# Altium schematic sheet Serial.SchDoc: Serial connection
size A4; DrawnBy: Jarod Krane; SheetNumber: 8; SheetTotal: 8
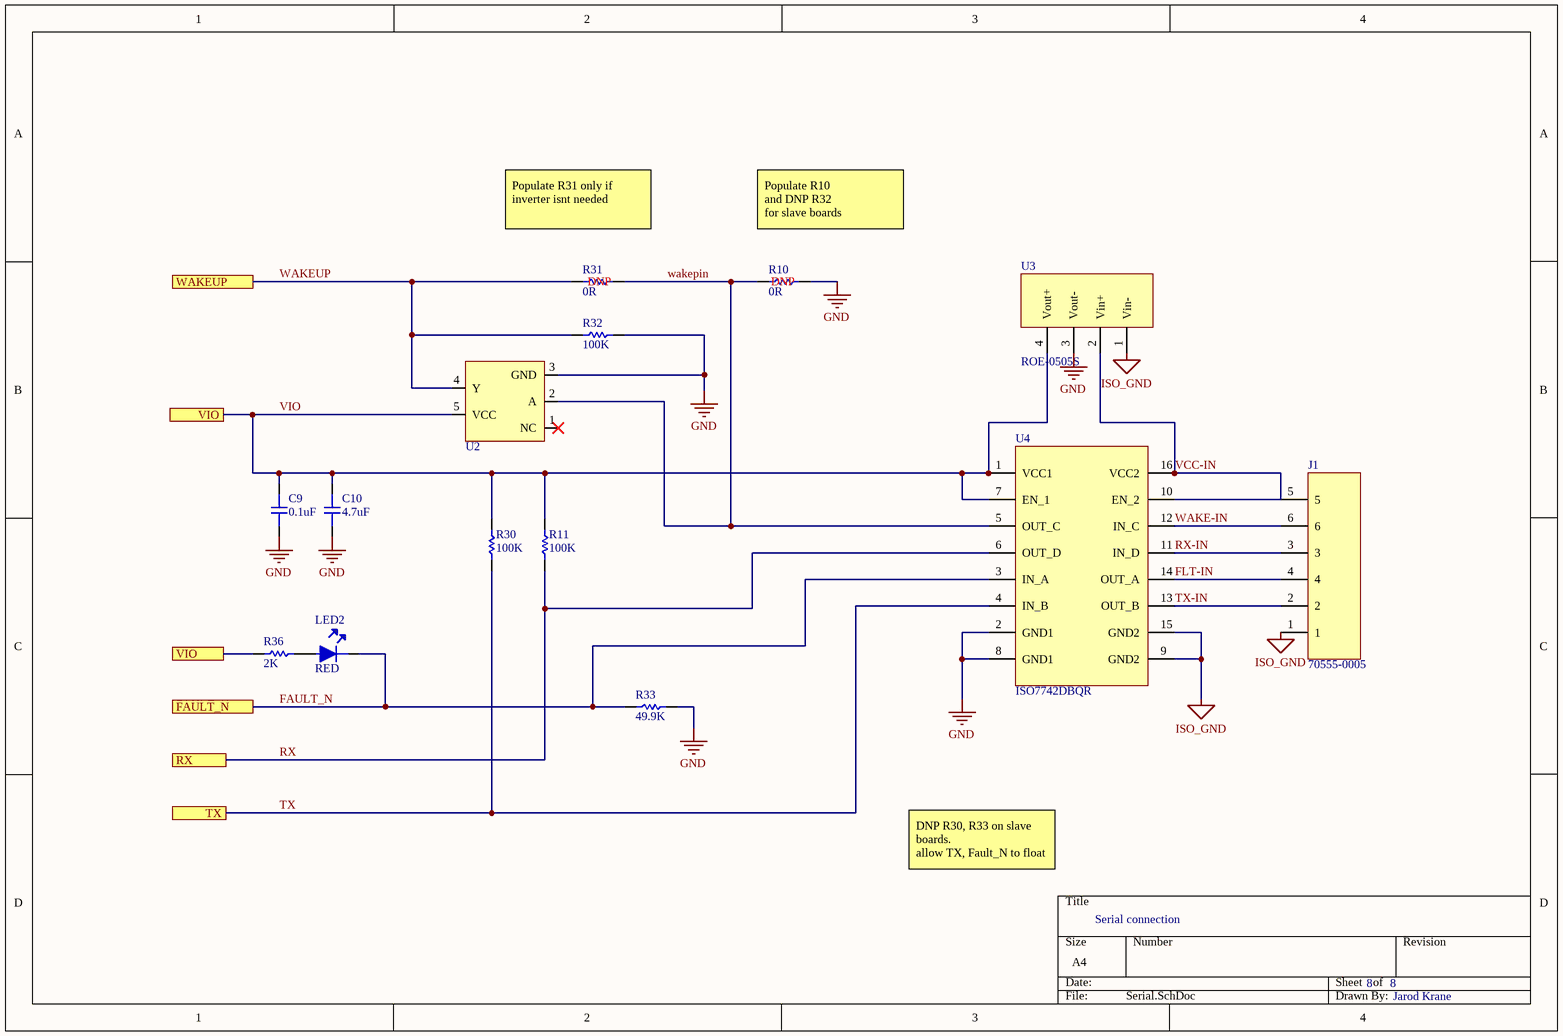
[diagram p0: Serial.SchDoc]

## Parts
C9  0.1uF  [0603 CAP - duplicate]
C10  4.7uF  [0805 CAP]
J1  70555-0005  [SERIAL HDR]
LED2  RED  [LED2]
R10  0R  [1206 RES]
R11  100K  [0603 RES]
R30  100K  [0603 RES]
R31  0R  [1206 RES]
R32  100K  [0603 RES]
R33  49.9K  [0603 RES]
R36  2K  [0603 RES]
U2  NC7SZ04M5X  [Inverter]  (value not drawn)
U3  ROE-0505S  [5V-ISO]
U4  ISO7742DBQR  [Serial-ISO]

## Ports
FAULT_N, RX, TX, VIO, WAKEUP

## Nets
GND: C9.1 C10.1 R10.2 R32.2 R33.2 U2.3(GND) U3.3(Vout-) U4.2(GND1) U4.8(GND1)
ISO_GND: J1.1 U3.1(Vin-) U4.9(GND2) U4.15(GND2)
FAULT_N: LED2.2 R33.1 U4.3(IN_A) ; port FAULT_N
FLT-IN: J1.4 U4.14(OUT_A)
RX: R11.1 U4.6(OUT_D) ; port RX
RX-IN: J1.3 U4.11(IN_D)
TX: R30.1 U4.4(IN_B) ; port TX
TX-IN: J1.2 U4.13(OUT_B)
VCC-IN: J1.5 U3.2(Vin+) U4.10(EN_2) U4.16(VCC2)
VIO: C9.2 C10.2 R11.2 R30.2 R36.2 U2.5(VCC) U3.4(Vout+) U4.1(VCC1) U4.7(EN_1) ; port VIO
WAKE-IN: J1.6 U4.12(IN_C)
wakepin: R10.1 R31.2 U2.2(A) U4.5(OUT_C)
WAKEUP: R31.1 R32.1 U2.4(Y) ; port WAKEUP
NetLED2_1: LED2.1 R36.1

Not connected (* = marked no-connect by the designer): U2 1(NC)*

## Notes on the sheet
- (near R31) Populate R31 only if inverter isnt needed
- (near R10) Populate R10
  and DNP R32
  for slave boards
- (near R31) DNP
- (near R10) DNP
- DNP R30, R33 on slave boards.
  allow TX, Fault_N to float
- 8

## Library data of the parts
C9 = 06035C104KAZ2A: CAP CER 0.1UF 50V X7R 0603; Manufacturer: Kyocera AVX; Capacitance: 100nF; Tolerance: 10%; Temperature Coefficient: 30ppm/°C; Supplier 1: Digi-Key; Manufacturer Part Number: 06035C104KAZ2A; Stock 1: 40000; Pricing 1: 1=0.23, 10=0.161, 100=0.0756, 500=0.053, 1000=0.0439 (USD); Mount: PCB,Surface Mount; Case/Package: 0603; Number of Pins: 2; Case Code (Metric): 1608; Case Code (Imperial): 0603; Contact Plating: Matte,Tin; Min Operating Temperature: -55°C; Max Operating Temperature: 125°C; Package Quantity: 1; Voltage Rating: 50V; Packaging: Tape and Reel; Voltage Rating (DC): 50V; Dielectric: X7R; Termination: SMD/SMT; Voltage: 50V; Features: Soft Termination; Length: 1.6mm; Height: 0.94mm; Width: 0.032inch; Thickness: 0.035inch; Depth: 0.81mm; Radiation Hardening: No; REACH SVHC: No SVHC; Lead Free: Lead Free; Supplier Part Number 1: 478-3540-1-ND
C10 = CL21B475KOFNFNE: CAP CER 4.7UF 16V X7R 0805; Manufacturer: Samsung; Tolerance: 10%; Supplier 1: Digi-Key; Manufacturer Part Number: CL21B475KOFNFNE; Stock 1: 20000; Pricing 1: 1=0.3, 10=0.208, 100=0.1181, 500=0.0833, 1000=0.0729 (USD); Mount: Surface Mount; Case/Package: 0805; Case Code (Metric): 2012; Case Code (Imperial): 0805; Min Operating Temperature: -55°C; Max Operating Temperature: 125°C; Package Quantity: 1; Packaging: Tape and Reel; Capacitance: 4.7uF; Voltage Rating: 16V; Dielectric: X7R; Length: 0.079inch; Height: 1.25mm; Width: 0.049inch; Thickness: 0.053inch; Depth: 1.25mm; Radiation Hardening: No; Supplier Part Number 1: 1276-2970-1-ND
J1 = 70555-0005: CONN HEADER 6POS .100 R/A TIN; Manufacturer: Molex; Contact Resistance: 30mR; Number of Contacts: 6; Current Rating: 3A; Voltage Rating: 250V; Gender: Female; Insulation Resistance: 1GR; Connector Type: Male Pin; Pitch: 2.54mm; Glow Wire Compliant: Non-compliant; Supplier 1: Digi-Key; Manufacturer Part Number: 70555-0005; Stock 1: 1593; Pricing 1: 1=1.19, 10=1.046, 100=0.902, 500=0.738, 1000=0.656, 5000=0.574, 10000=0.5453 (USD); Mount: Through Hole; Contact Plating: Tin; Contact Material: Brass,Bronze; Housing Color: Black; Housing Material: Polyester; Color: Black; Material: Brass; Min Operating Temperature: -40°C; Max Operating Temperature: 105°C; Number of Rows: 1; Packaging: Rail/Tube; Termination: Solder; Orientation: Right Angle; Package Quantity: 1; Contact Gender: Male; Number of Positions: 6; Voltage Rating (DC): 250V; Number of Circuits: 6; Length: 18.69mm; Depth: 13.59mm; Contact Mating Length: 0.24inch; ELV: Compliant; Flammability Rating: UL94 V-0; ComponentLink1URL: https://www.molex.com/pdm_docs/ps/PS-70400.pdf; ComponentLink1Description: https://www.molex.com/pdm_docs/ps/PS-70400.pdf; ComponentLink2URL: http://www.mouser.com/ds/2/276/0705550005_PCB_HEADERS-172795.pdf; ComponentLink2Description: http://www.mouser.com/ds/2/276/0705550005_PCB_HEADERS-172795.pdf; Supplier Part Number 1: WM4168-ND
LED2 = 150060VS75000: LED GREEN CLEAR 0603 SMD; Manufacturer: Wurth Electronics; Luminous Intensity: 40mcd; Viewing Angle: 140°; Forward Voltage: 2V; Wavelength: 570nm; Lens Style: Clear,Rectangular; Forward Current: 30mA; Test Current: 20mA; Supplier 1: Digi-Key; Manufacturer Part Number: 150060VS75000; Stock 1: 219425; Pricing 1: 1=0.14, 50=0.129, 100=0.11, 500=0.095 (USD); Mount: Surface Mount; Case/Package: 0603; Number of Pins: 2; Colour: Green; Case Code (Metric): 1608; Case Code (Imperial): 0603; Min Operating Temperature: -40°C; Max Operating Temperature: 85°C; Package Quantity: 1; Packaging: Tape and Reel; Dominant Wavelength: 570nm; Length: 1.6mm; Height: 0.7mm; Width: 0.8mm; REACH SVHC: Unknown; ComponentLink1URL: http://www.farnell.com/datasheets/1911347.pdf; ComponentLink1Description: http://www.farnell.com/datasheets/1911347.pdf; ComponentLink2URL: https://katalog.we-online.de/led/datasheet/150060VS75000.pdf; ComponentLink2Description: https://katalog.we-online.de/led/datasheet/150060VS75000.pdf; ComponentLink3URL: https://www.distrelec.biz/Web/Downloads/_t/ds/150060VS75000_eng_tds.pdf?mime=application%2Fpdf; ComponentLink3Description: https://www.distrelec.biz/Web/Downloads/_t/ds/150060VS75000_eng_tds.pdf?mime=application%2Fpdf; ComponentLink4URL: http://www.produktinfo.conrad.com/datenblaetter/750000-774999/759431-da-01-en-CHIPLED_0603_W_KL_H_GRUEN_150060VS7500.pdf; ComponentLink4Description: http://www.produktinfo.conrad.com/datenblaetter/750000-774999/759431-da-01-en-CHIPLED_0603_W_KL_H_GRUEN_150060VS7500.pdf; Supplier Part Number 1: 732-4980-1-ND
R10 R31 = 0
R11 R30 R32 = ERJ-3EKF1003V: RES SMD 100K OHM 1% 1/10W 0603; Manufacturer: Panasonic; Manufacturer Part Number: ERJ3EKF-1003V; Resistance: 100kR; Power Rating: 100mW; Voltage Rating: 75V; Temperature Coefficient: 100ppm/°C; Supplier 1: Digi-Key; Stock 1: 10349154; Pricing 1: 1=0.1, 10=0.064, 100=0.0261, 1000=0.0117, 2500=0.0102 (USD); Case/Package: 0603; Number of Pins: 2; Case Code (Metric): 1608; Case Code (Imperial): 0603; Contact Plating: Tin; Min Operating Temperature: -55°C; Max Operating Temperature: 155°C; Tolerance: 1%; Packaging: Tape and Reel; Composition: Thick Film; Military Standard: Not; Voltage Rating (DC): 75V; Length: 1.6mm; Depth: 0.8mm; Width: 800um; Radiation Hardening: No; REACH SVHC: No SVHC; Lead Free: Lead Free; Supplier Part Number 1: P100KHCT-ND
R33 = RC0603FR-0749K9L: RES SMD 49.9K OHM 1% 1/10W 0603
R36 = CRCW06032K00FKEA: RES SMD 2K OHM 1% 1/10W 0603; Manufacturer: Vishay; Power Rating: 100mW; Resistance: 2kR; Voltage Rating: 75V; Temperature Coefficient: 100ppm/°C; Supplier 1: Digi-Key; Manufacturer Part Number: CRCW06032K00FKEA; Stock 1: 388348; Pricing 1: 1=0.1, 10=0.042, 100=0.017, 1000=0.0076, 2500=0.0066 (USD); Mount: Surface Mount; Case/Package: 0603; Number of Pins: 2; Weight: 7.1E-05oz; Case Code (Imperial): 0603; Case Code (Metric): 1608; Contact Plating: Lead,Tin; Min Operating Temperature: -55°C; Max Operating Temperature: 155°C; Tolerance: 1%; Packaging: Tape and Reel; Composition: Thick Film; Package Quantity: 10; Military Standard: Not; Termination: Solder; Voltage Rating (DC): 75V; Number of Terminations: 2; Max Power Dissipation: 100mW; Features: Automotive AEC-Q200; Length: 1.55mm; Height: 0.45mm; Width: 0.85mm; Depth: 0.85mm; Radiation Hardening: No; REACH SVHC: Unknown; Lead Free: Lead Free; Supplier Part Number 1: 541-2.00KHCT-ND
U2 = NC7SZ04M5X: IC INVERTER 1CH 1-INP SOT23-5; Manufacturer: ON Semiconductor / Fairchild; Max Supply Voltage: 5.5V; Min Supply Voltage: 1.65V; Logic Function: Buffer,Inverter; High Level Output Current: -32mA; Low Level Output Current: 32mA; Propagation Delay: 12ns; Number of Circuits: 1; Quiescent Current: 2uA; Supplier 1: Digi-Key; Manufacturer Part Number: NC7SZ04M5X; Stock 1: 204255; Pricing 1: 1=0.48, 10=0.358, 100=0.203, 500=0.1344, 1000=0.1031 (USD); Mount: Surface Mount; Case/Package: SOT-23; Number of Pins: 5; Weight: 0.03g; Contact Plating: Tin,Matte; Min Operating Temperature: -40°C; Max Operating Temperature: 85°C; Packaging: Tape and Reel; Package Quantity: 1; Number of Inputs: 1; Output Current: 32mA; Number of Elements: 1; Turn-On Delay Time: 12ns; Radiation Hardening: No; REACH SVHC: No SVHC; Lead Free: Lead Free; ComponentLink1URL: http://www.jameco.com/Jameco/Products/ProdDS/1015511.pdf?src-supplier=Jameco; ComponentLink1Description: http://www.jameco.com/Jameco/Products/ProdDS/1015511.pdf?src-supplier=Jameco; ComponentLink2URL: https://www.fairchildsemi.com/datasheets/NC/NC7SZ04.pdf?src-supplier=Digi-Key; ComponentLink2Description: https://www.fairchildsemi.com/datasheets/NC/NC7SZ04.pdf?src-supplier=Digi-Key; ComponentLink3URL: http://www.farnell.com/datasheets/1639856.pdf?src-supplier=Element14; ComponentLink3Description: http://www.farnell.com/datasheets/1639856.pdf?src-supplier=Element14; ComponentLink4URL: http://www.fairchildsemi.com/ds/NC/NC7SZ04.pdf?src-supplier=Avnet+Europe; ComponentLink4Description: http://www.fairchildsemi.com/ds/NC/NC7SZ04.pdf?src-supplier=Avnet+Europe; ComponentLink5URL: https://www.verical.com/server-webapp/html/getDatasheet?partID=120911&src-supplier=Verical; ComponentLink5Description: https://www.verical.com/server-webapp/html/getDatasheet?partID=120911&src-supplier=Verical; ComponentLink6URL: https://www.fairchildsemi.com/datasheets/NC/NC7SZ04.pdf?src-supplier=Avnet; ComponentLink6Description: https://www.fairchildsemi.com/datasheets/NC/NC7SZ04.pdf?src-supplier=Avnet; ComponentLink7URL: http://www.fairchildsemi.com/ds/NC/NC7SZ04.pdf?src-supplier=Future+Electronics; ComponentLink7Description: http://www.fairchildsemi.com/ds/NC/NC7SZ04.pdf?src-supplier=Future+Electronics; Supplier Part Number 1: NC7SZ04M5XCT-ND
U3 = 945-1655-5-ND: DC DC CONVERTER 5V 1W
U4 = 296-49658-1-ND: DG ISO 2.5KV 4CH GEN PRP 16SSOP